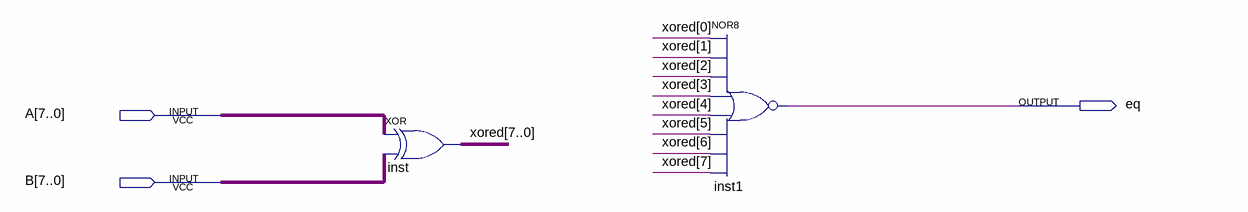
[diagram p0: schematic sheet]
// Quartus schematic cmp8_eq.bdf as structural Verilog: 2 symbols, 3 pins
module cmp8_eq (
  input  [7:0] A,
  input  [7:0] B,
  output eq
);

  wire [7:0] xored;

  assign xored = A ^ B;  // XOR inst, 8 bits wide
  nor inst1 (eq, xored[0], xored[1], xored[2], xored[3], xored[4], xored[5], xored[6], xored[7]);
endmodule
